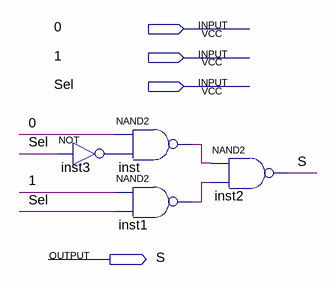
[diagram p0: schematic sheet]
// Quartus schematic MUX_1bit.bdf as structural Verilog: 4 symbols, 4 pins
module MUX_1bit (
  input  \0 ,
  input  \1 ,
  input  Sel,
  output S
);

  wire inst1_out, inst3_out, inst_out;

  not inst3 (inst3_out, Sel);
  nand inst (inst_out, \0 , inst3_out);
  nand inst1 (inst1_out, \1 , Sel);
  nand inst2 (S, inst_out, inst1_out);
endmodule
